# Altium project proj_arhipov_control_board.PrjPcb
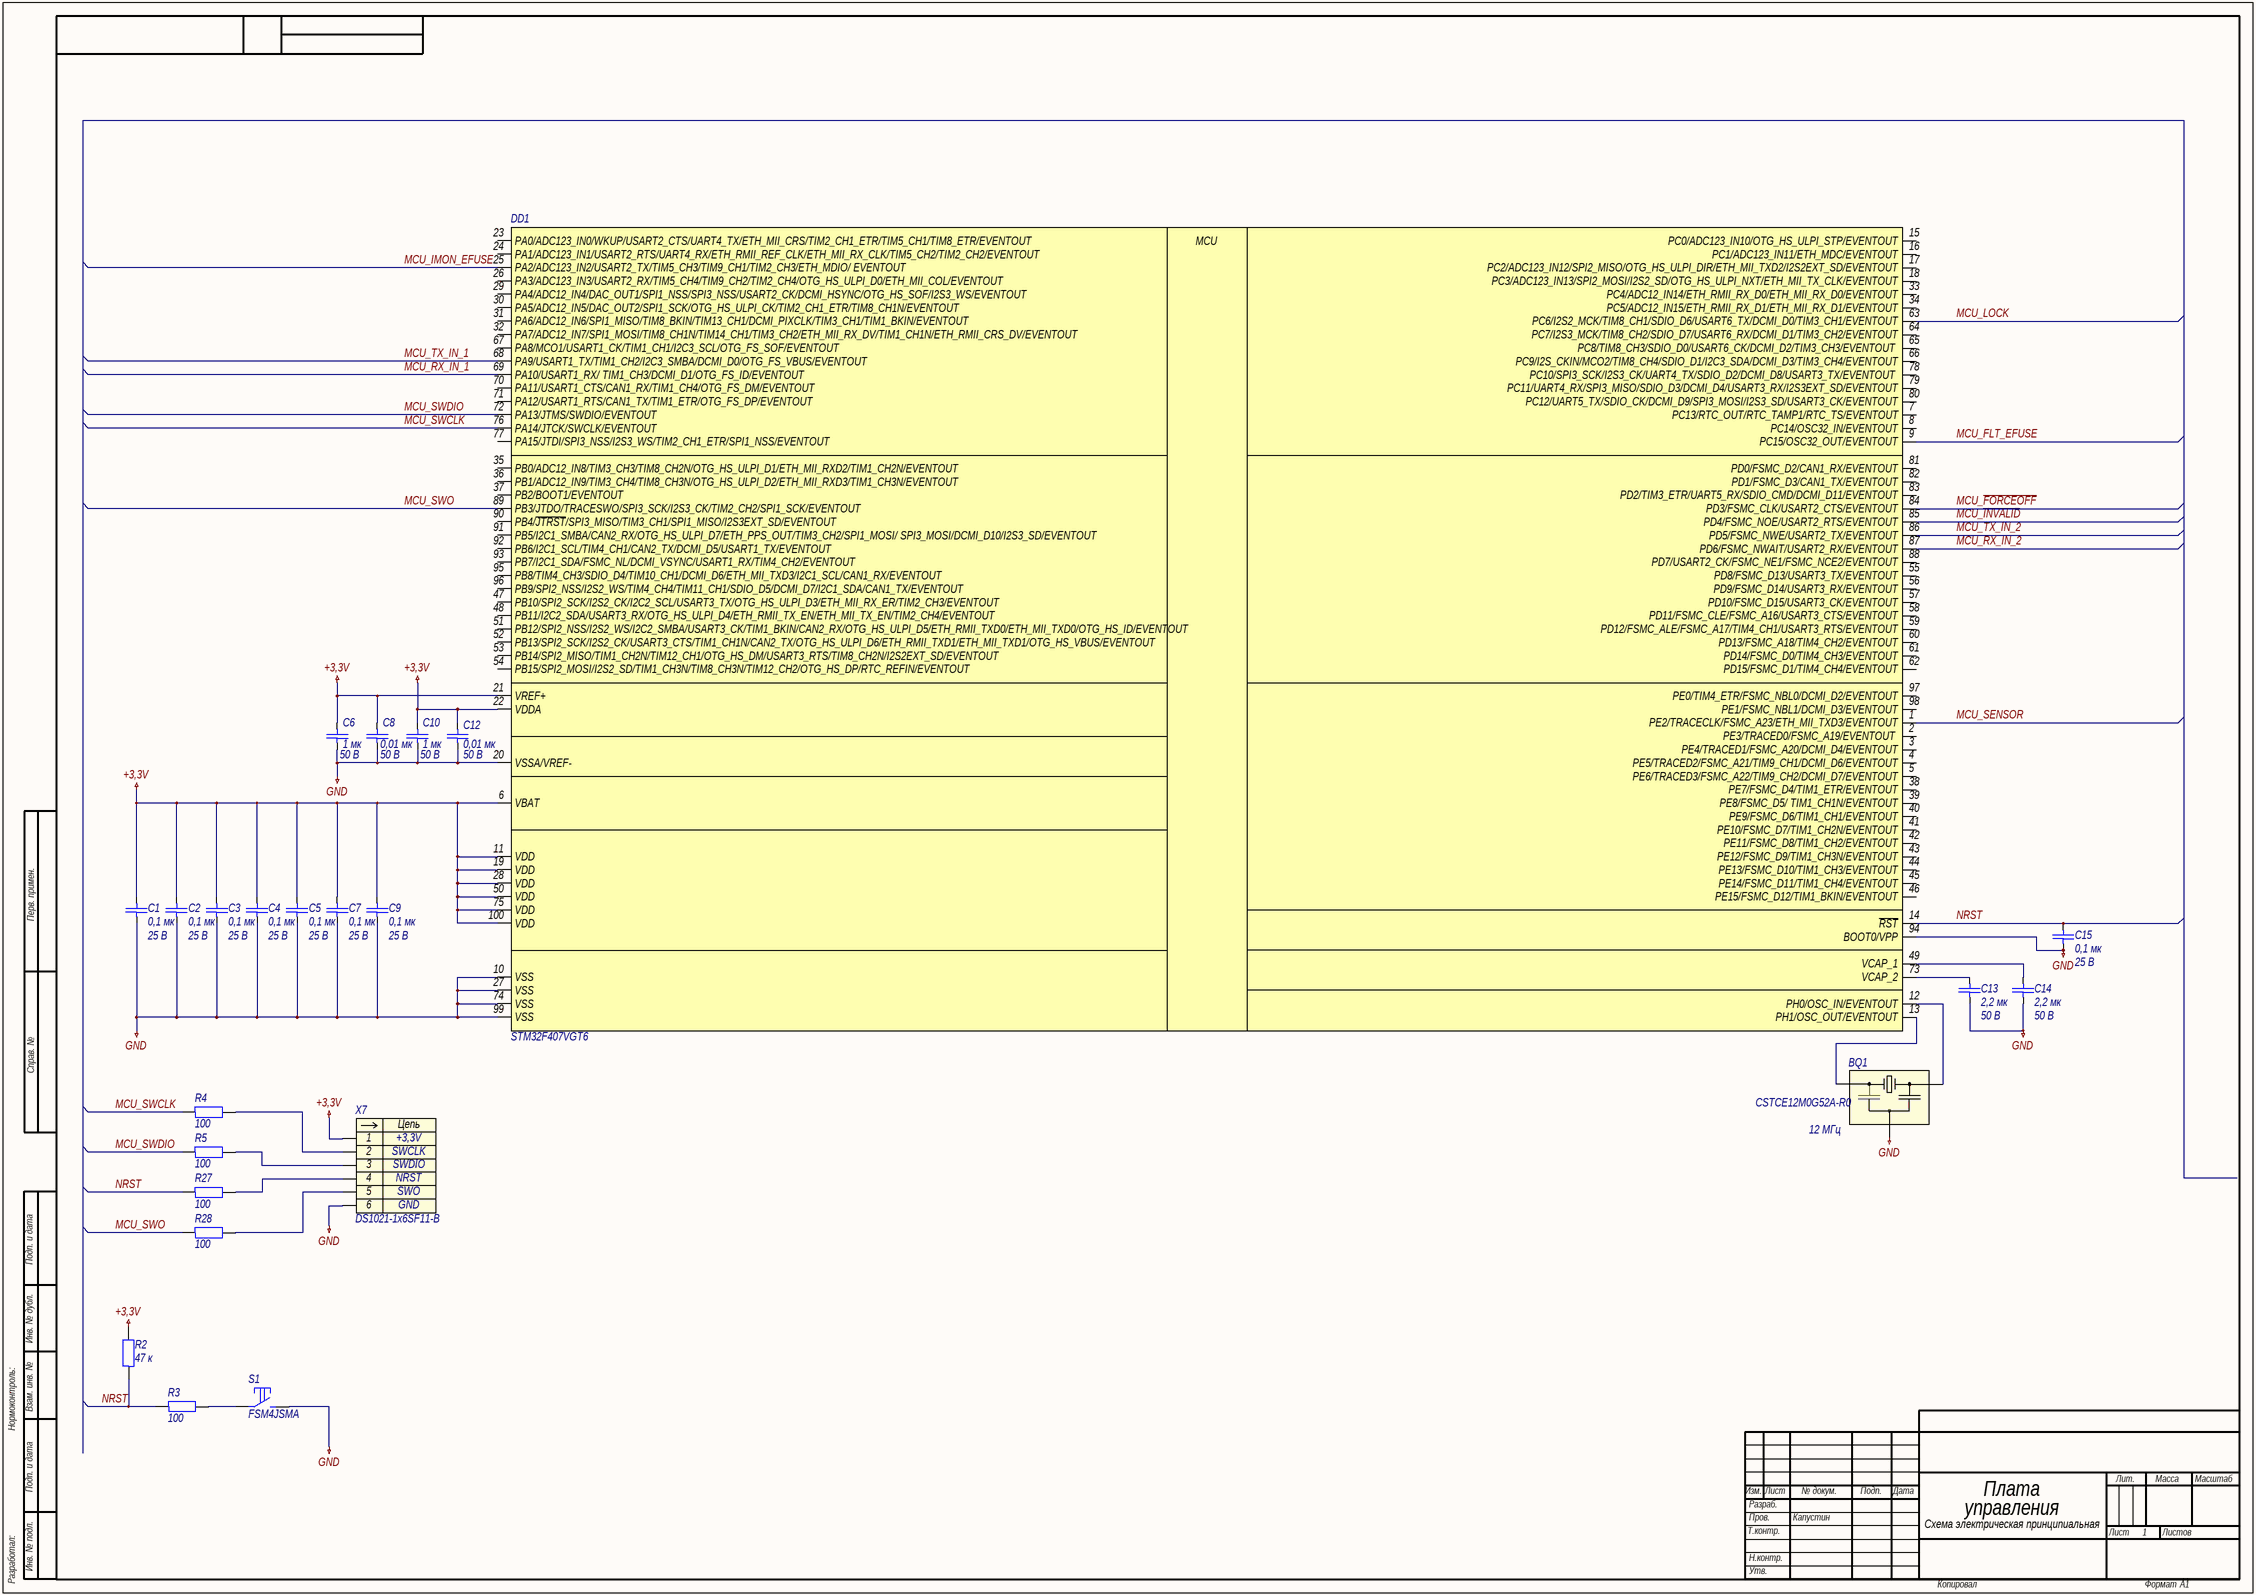
[diagram p0: proj_arhipov_mcu.SchDoc]
approver: Капустин; check: Капустин; designation: СПБПУ.3331506.001; developer: Архипов; document_code: Ý3; document_type: Схема электрическая принципиальная; pcb_dec_number: СПБПУ.3331506.001; project: Плата управления; sheets_total: M; title: Плата управления; title_line_1: Плата; title_line_2: управления
4 sheets, 98 parts. Net scope: global (net labels, ports and power ports of the same name join across sheets).
Board file: proj_arhipov_control_doard.PcbDoc
Sheets:
  proj_arhipov_mcu.SchDoc
  proj_arhipov_buck.SchDoc
  proj_arhipov_uart_rs232.SchDoc
  proj_arhipov_elements_control.SchDoc

## Sheet proj_arhipov_mcu.SchDoc: Плата управления
size 840 x 594 mm; ApprovedBy: Капустин; CheckedBy: Капустин; DrawnBy: Архипов; DocumentNumber: СПБПУ.3331506.001Ý3; SheetNumber: 1; SheetTotal: M; DocumentCode: Ý3; ImagePath: СПБПУ.3331506.001

### Parts
BQ1  CSTCE12M0G52A-R0  Частотa: 12 МГц  [CSTCE-3-320X130X70]
C1  0,1 мк  Напряжение: 25 В  [C0603]
C2  0,1 мк  Напряжение: 25 В  [C0603]
C3  0,1 мк  Напряжение: 25 В  [C0603]
C4  0,1 мк  Напряжение: 25 В  [C0603]
C5  0,1 мк  Напряжение: 25 В  [C0603]
C6  1 мк  Напряжение: 50 В  [C0603]
C7  0,1 мк  Напряжение: 25 В  [C0603]
C8  0,01 мк  Напряжение: 50 В  [C0603]
C9  0,1 мк  Напряжение: 25 В  [C0603]
C10  1 мк  Напряжение: 50 В  [C0603]
C12  0,01 мк  Напряжение: 50 В  [C0603]
C13  2,2 мк  Напряжение: 50 В  [C0603]
C14  2,2 мк  Напряжение: 50 В  [C0603]
C15  0,1 мк  Напряжение: 25 В  [C0603]
DD1  STM32F407VGT6  [LQFP-100-P50-1400X1400X160-L60X22]
R2  47 к  [R0603]
R3  100  [R0603]
R4  100  [R0603]
R5  100  [R0603]
R27  100  [R0603]
R28  100  [R0603]
S1  FSM4JSMA  [FSM4JSMA]
X7  DS1021-1x6SF11-B  [DS1021-1X6SF11-B]

### Nets
+3,3V: C1.1 C2.1 C3.1 C4.1 C5.1 C6.1 C7.1 C8.1 C9.1 C10.1 C12.1 DD1.6(VBAT) DD1.11(VDD) DD1.19(VDD) DD1.21(VREF+) DD1.22(VDDA) DD1.28(VDD) DD1.50(VDD) DD1.75(VDD) DD1.100(VDD) R2.2 X7.1
GND: BQ1.2 C1.2 C2.2 C3.2 C4.2 C5.2 C6.2 C7.2 C8.2 C9.2 C10.2 C12.2 C13.2 C14.2 C15.2 DD1.10(VSS) DD1.20(VSSA/VREF-) DD1.27(VSS) DD1.74(VSS) DD1.94(BOOT0/VPP) DD1.99(VSS) S1.2 X7.6
MCU_~{FORCEOFF}: DD1.84(PD3/FSMC_CLK/USART2_CTS/EVENTOUT)
MCU_FLT_EFUSE: DD1.9(PC15/OSC32_OUT/EVENTOUT)
MCU_~{INVALID}: DD1.85(PD4/FSMC_NOE/USART2_RTS/EVENTOUT)
MCU_IMON_EFUSE: DD1.25(PA2/ADC123_IN2/USART2_TX/TIM5_CH3/TIM9_CH1/TIM2_CH3/ETH_MDIO/_EVENTOUT)
MCU_LOCK: DD1.63(PC6/I2S2_MCK/TIM8_CH1/SDIO_D6/USART6_TX/DCMI_D0/TIM3_CH1/EVENTOUT)
MCU_RX_IN_1: DD1.69(PA10/USART1_RX/_TIM1_CH3/DCMI_D1/OTG_FS_ID/EVENTOUT)
MCU_RX_IN_2: DD1.87(PD6/FSMC_NWAIT/USART2_RX/EVENTOUT)
MCU_SENSOR: DD1.1(PE2/TRACECLK/FSMC_A23/ETH_MII_TXD3/EVENTOUT)
MCU_SWCLK: DD1.76(PA14/JTCK/SWCLK/EVENTOUT) R4.1
MCU_SWDIO: DD1.72(PA13/JTMS/SWDIO/EVENTOUT) R5.1
MCU_SWO: DD1.89(PB3/JTDO/TRACESWO/SPI3_SCK/I2S3_CK/TIM2_CH2/SPI1_SCK/EVENTOUT) R28.1
MCU_TX_IN_1: DD1.68(PA9/USART1_TX/TIM1_CH2/I2C3_SMBA/DCMI_D0/OTG_FS_VBUS/EVENTOUT)
MCU_TX_IN_2: DD1.86(PD5/FSMC_NWE/USART2_TX/EVENTOUT)
NRST: C15.1 DD1.14(~{RST}) R2.1 R3.1 R27.1
NetBQ1_1: BQ1.1 DD1.12(PH0/OSC_IN/EVENTOUT)
NetBQ1_3: BQ1.3 DD1.13(PH1/OSC_OUT/EVENTOUT)
NetC13_1: C13.1 DD1.73(VCAP_2)
NetC14_1: C14.1 DD1.49(VCAP_1)
NetR3_2: R3.2 S1.1
NetR4_2: R4.2 X7.2
NetR5_2: R5.2 X7.3
NetR27_2: R27.2 X7.4
NetR28_2: R28.2 X7.5

Not connected (* = marked no-connect by the designer): DD1 2(PE3/TRACED0/FSMC_A19/EVENTOUT_) 3(PE4/TRACED1/FSMC_A20/DCMI_D4/EVENTOUT) 4(PE5/TRACED2/FSMC_A21/TIM9_CH1/DCMI_D6/EVENTOUT) 5(PE6/TRACED3/FSMC_A22/TIM9_CH2/DCMI_D7/EVENTOUT) 7(PC13/RTC_OUT/RTC_TAMP1/RTC_TS/EVENTOUT) 8(PC14/OSC32_IN/EVENTOUT) 15(PC0/ADC123_IN10/OTG_HS_ULPI_STP/EVENTOUT) 16(PC1/ADC123_IN11/ETH_MDC/EVENTOUT) 17(PC2/ADC123_IN12/SPI2_MISO/OTG_HS_ULPI_DIR/ETH_MII_TXD2/I2S2EXT_SD/EVENTOUT) 18(PC3/ADC123_IN13/SPI2_MOSI/I2S2_SD/OTG_HS_ULPI_NXT/ETH_MII_TX_CLK/EVENTOUT) 23(PA0/ADC123_IN0/WKUP/USART2_CTS/UART4_TX/ETH_MII_CRS/TIM2_CH1_ETR/TIM5_CH1/TIM8_ETR/EVENTOUT) 24(PA1/ADC123_IN1/USART2_RTS/UART4_RX/ETH_RMII_REF_CLK/ETH_MII_RX_CLK/TIM5_CH2/TIM2_CH2/EVENTOUT) 26(PA3/ADC123_IN3/USART2_RX/TIM5_CH4/TIM9_CH2/TIM2_CH4/OTG_HS_ULPI_D0/ETH_MII_COL/EVENTOUT) 29(PA4/ADC12_IN4/DAC_OUT1/SPI1_NSS/SPI3_NSS/USART2_CK/DCMI_HSYNC/OTG_HS_SOF/I2S3_WS/EVENTOUT) 30(PA5/ADC12_IN5/DAC_OUT2/SPI1_SCK/OTG_HS_ULPI_CK/TIM2_CH1_ETR/TIM8_CH1N/EVENTOUT) 31(PA6/ADC12_IN6/SPI1_MISO/TIM8_BKIN/TIM13_CH1/DCMI_PIXCLK/TIM3_CH1/TIM1_BKIN/EVENTOUT) 32(PA7/ADC12_IN7/SPI1_MOSI/TIM8_CH1N/TIM14_CH1/TIM3_CH2/ETH_MII_RX_DV/TIM1_CH1N/ETH_RMII_CRS_DV/EVENTOUT) 33(PC4/ADC12_IN14/ETH_RMII_RX_D0/ETH_MII_RX_D0/EVENTOUT) 34(PC5/ADC12_IN15/ETH_RMII_RX_D1/ETH_MII_RX_D1/EVENTOUT) 35(PB0/ADC12_IN8/TIM3_CH3/TIM8_CH2N/OTG_HS_ULPI_D1/ETH_MII_RXD2/TIM1_CH2N/EVENTOUT) 36(PB1/ADC12_IN9/TIM3_CH4/TIM8_CH3N/OTG_HS_ULPI_D2/ETH_MII_RXD3/TIM1_CH3N/EVENTOUT) 37(PB2/BOOT1/EVENTOUT) 38(PE7/FSMC_D4/TIM1_ETR/EVENTOUT) 39(PE8/FSMC_D5/_TIM1_CH1N/EVENTOUT) 40(PE9/FSMC_D6/TIM1_CH1/EVENTOUT) 41(PE10/FSMC_D7/TIM1_CH2N/EVENTOUT) 42(PE11/FSMC_D8/TIM1_CH2/EVENTOUT) 43(PE12/FSMC_D9/TIM1_CH3N/EVENTOUT) 44(PE13/FSMC_D10/TIM1_CH3/EVENTOUT) 45(PE14/FSMC_D11/TIM1_CH4/EVENTOUT) 46(PE15/FSMC_D12/TIM1_BKIN/EVENTOUT) 47(PB10/SPI2_SCK/I2S2_CK/I2C2_SCL/USART3_TX/OTG_HS_ULPI_D3/ETH_MII_RX_ER/TIM2_CH3/EVENTOUT) 48(PB11/I2C2_SDA/USART3_RX/OTG_HS_ULPI_D4/ETH_RMII_TX_EN/ETH_MII_TX_EN/TIM2_CH4/EVENTOUT) 51(PB12/SPI2_NSS/I2S2_WS/I2C2_SMBA/USART3_CK/TIM1_BKIN/CAN2_RX/OTG_HS_ULPI_D5/ETH_RMII_TXD0/ETH_MII_TXD0/OTG_HS_ID/EVENTOUT) 52(PB13/SPI2_SCK/I2S2_CK/USART3_CTS/TIM1_CH1N/CAN2_TX/OTG_HS_ULPI_D6/ETH_RMII_TXD1/ETH_MII_TXD1/OTG_HS_VBUS/EVENTOUT) 53(PB14/SPI2_MISO/TIM1_CH2N/TIM12_CH1/OTG_HS_DM/USART3_RTS/TIM8_CH2N/I2S2EXT_SD/EVENTOUT) 54(PB15/SPI2_MOSI/I2S2_SD/TIM1_CH3N/TIM8_CH3N/TIM12_CH2/OTG_HS_DP/RTC_REFIN/EVENTOUT) 55(PD8/FSMC_D13/USART3_TX/EVENTOUT) 56(PD9/FSMC_D14/USART3_RX/EVENTOUT) 57(PD10/FSMC_D15/USART3_CK/EVENTOUT) 58(PD11/FSMC_CLE/FSMC_A16/USART3_CTS/EVENTOUT) 59(PD12/FSMC_ALE/FSMC_A17/TIM4_CH1/USART3_RTS/EVENTOUT) 60(PD13/FSMC_A18/TIM4_CH2/EVENTOUT) 61(PD14/FSMC_D0/TIM4_CH3/EVENTOUT) 62(PD15/FSMC_D1/TIM4_CH4/EVENTOUT) 64(PC7/I2S3_MCK/TIM8_CH2/SDIO_D7/USART6_RX/DCMI_D1/TIM3_CH2/EVENTOUT) 65(PC8/TIM8_CH3/SDIO_D0/USART6_CK/DCMI_D2/TIM3_CH3/EVENTOUT_) 66(PC9/I2S_CKIN/MCO2/TIM8_CH4/SDIO_D1/I2C3_SDA/DCMI_D3/TIM3_CH4/EVENTOUT) 67(PA8/MCO1/USART1_CK/TIM1_CH1/I2C3_SCL/OTG_FS_SOF/EVENTOUT) 70(PA11/USART1_CTS/CAN1_RX/TIM1_CH4/OTG_FS_DM/EVENTOUT) 71(PA12/USART1_RTS/CAN1_TX/TIM1_ETR/OTG_FS_DP/EVENTOUT) 77(PA15/JTDI/SPI3_NSS/I2S3_WS/TIM2_CH1_ETR/SPI1_NSS/EVENTOUT) 78(PC10/SPI3_SCK/I2S3_CK/UART4_TX/SDIO_D2/DCMI_D8/USART3_TX/EVENTOUT_) 79(PC11/UART4_RX/SPI3_MISO/SDIO_D3/DCMI_D4/USART3_RX/I2S3EXT_SD/EVENTOUT) 80(PC12/UART5_TX/SDIO_CK/DCMI_D9/SPI3_MOSI/I2S3_SD/USART3_CK/EVENTOUT) 81(PD0/FSMC_D2/CAN1_RX/EVENTOUT) 82(PD1/FSMC_D3/CAN1_TX/EVENTOUT) 83(PD2/TIM3_ETR/UART5_RX/SDIO_CMD/DCMI_D11/EVENTOUT) 88(PD7/USART2_CK/FSMC_NE1/FSMC_NCE2/EVENTOUT) 90(PB4/~{JTRST}/SPI3_MISO/TIM3_CH1/SPI1_MISO/I2S3EXT_SD/EVENTOUT) 91(PB5/I2C1_SMBA/CAN2_RX/OTG_HS_ULPI_D7/ETH_PPS_OUT/TIM3_CH2/SPI1_MOSI/_SPI3_MOSI/DCMI_D10/I2S3_SD/EVENTOUT) 92(PB6/I2C1_SCL/TIM4_CH1/CAN2_TX/DCMI_D5/USART1_TX/EVENTOUT) 93(PB7/I2C1_SDA/FSMC_NL/DCMI_VSYNC/USART1_RX/TIM4_CH2/EVENTOUT) 95(PB8/TIM4_CH3/SDIO_D4/TIM10_CH1/DCMI_D6/ETH_MII_TXD3/I2C1_SCL/CAN1_RX/EVENTOUT) 96(PB9/SPI2_NSS/I2S2_WS/TIM4_CH4/TIM11_CH1/SDIO_D5/DCMI_D7/I2C1_SDA/CAN1_TX/EVENTOUT) 97(PE0/TIM4_ETR/FSMC_NBL0/DCMI_D2/EVENTOUT) 98(PE1/FSMC_NBL1/DCMI_D3/EVENTOUT)

### Notes on the sheet
- Перв. примен.
- Справ. №
- Подп. и дата
- Инв. № дубл.
- Нормоконтроль:
- Взам. инв. №
- Изм.
- Лист
- № докум.
- Подп.
- Дата
- Лит.
- Масса
- Масштаб
- Т.контр.
- Пров.
- Разраб.
- Листов
- Разработал:
- Инв. № подл.
- Н.контр.
- Утв.
- Копировал
- Формат
- А1
- (in symbol dd0001) MCU
- (in symbol x0016) Цепь

### Library data of the parts
BQ1 = bq0001: =Описание; ID: bq0001; Фамилия: Самарин; Описание: Кварцевый резонатор 12 МГц; Производитель: Murata Manufacturing Co., Ltd.; Корпус: 3,20 x 1,30 x 0,70; Наименование: CSTCE12M0G52A-R0; Частота: 12 МГц; HelpURL: https://www.murata.com/en-us/products/productdetail?partno=CSTCE12M0G52A-R0
C1-C5 C7 C9 C15 = c0058: =Описание; ID: c0058; Фамилия: Паньков; Описание: Конденсатор керамический чип 0603 100 нФ 25 В ±10 %; Наименование: CC0603KRX7R8BB104; Производитель: YAGEO Corp.; Отклонение: ±10 %; Рабочие температуры: от –55 °С до +125 °С; Температурный коэффициент емкости: X7R; Корпус: 0603; Номинал: 0,1 мк; Номинальное напряжение: 25 В; HelpURL: https://www.yageo.com/upload/media/product/productsearch/datasheet/mlcc/UPY-GPHC_X7R_6.3V-to-50V_20.pdf
C6 C10 = c0091: =Описание; ID: c0091; Фамилия: Самарин; Описание: Конденсатор керамический чип 0603 1 мкФ 50 В ±10 %; Наименование: CC0603KPX5R9BB105; Производитель: YAGEO Corp.; Отклонение: ±10 %; Рабочие температуры: от –55 °С до +85 °С; Температурный коэффициент емкости: X5R; Корпус: 0603; Номинал: 1 мк; Номинальное напряжение: 50 В; HelpURL: https://www.yageo.com/upload/media/product/productsearch/datasheet/mlcc/UPY-GPHC_X5R_4V-to-50V_26.pdf
C8 C12 = c0036: =Описание; ID: c0036; Фамилия: Паньков; Описание: Конденсатор керамический чип 0603 10 нФ 50 В ±10 %; Наименование: CC0603KRX7R9BB103; Производитель: YAGEO Corp.; Отклонение: ±10 %; Рабочие температуры: от –55 °С до +125 °С; Температурный коэффициент емкости: X7R; Корпус: 0603; Номинал: 0,01 мк; Номинальное напряжение: 50 В; HelpURL: https://www.yageo.com/upload/media/product/productsearch/datasheet/mlcc/UPY-GPHC_X7R_6.3V-to-50V_20.pdf
C13 C14 = c0102: =Описание; ID: c0102; Фамилия: Самарин; Описание: Конденсатор керамический чип 0603 2,2 мкФ 50 В ±10 %; Наименование: CC0603KRX5R9BB225; Производитель: YAGEO Corp.; Отклонение: ±10 %; Рабочие температуры: от –55 °С до +85 °С; Температурный коэффициент емкости: X5R; Корпус: 0603; Номинал: 2,2 мк; Номинальное напряжение: 50 В; HelpURL: https://www.yageo.com/upload/media/product/productsearch/datasheet/mlcc/UPY-GPHC_X5R_4V-to-50V_26.pdf
DD1 = dd0001: =Описание; ID: dd0001; Фамилия: Паньков; Описание: ARM Cortex-M4 32-разрядный микроконтроллер 168 МГц 1 Мбайт FLASH-памяти; Производитель: STMicroelectronics; Рабочее напряжение: от 1,8 В до 3,6 В; Максимальная тактовая частота: 168 МГц; Поддерживаемые интерфейсы: CAN, I2C, SDIO, I2S/SPI, UART/USART, USB; Рабочие температуры: от –40 °С до +85 °С; Корпус: LQFP-100; Наименование: STM32F407VGT6; HelpURL: https://www.st.com/en/microcontrollers-microprocessors/stm32f407vg.html
R2 = r0084: =Описание; ID: r0084; Фамилия: Паньков; Описание: Резистор чип 0603 47 кОм ±1 % 0,1 Вт; Наименование: RC0603FR-0747KL; Производитель: YAGEO Corp.; Отклонение: ±1 %; Номинальное напряжение: 75 В; Номинальный ток: 1 А; Рабочие температуры: от –55 °С до +155 °С; Корпус: 0603; Примечание: Ряд E24; Номинал: 47 к; HelpURL: https://www.yageo.com/upload/media/product/productsearch/datasheet/rchip/PYu-RC_Group_51_RoHS_L_11.pdf
R3-R5 R27 R28 = r0007: =Описание; ID: r0007; Фамилия: Самарин; Описание: Резистор чип 0603 100 Ом ±1 % 0,1 Вт; Наименование: RC0603FR‍‐07100RL; Производитель: YAGEO Corp.; Отклонение: ±1 %; Номинальное напряжение: 75 В; Номинальный ток: 1 А; Рабочие температуры: от –55 °С до +155 °С; Корпус: 0603; Примечание: Ряд E24; Номинал: 100; HelpURL: https://www.yageo.com/upload/media/product/productsearch/datasheet/rchip/PYu-RC_Group_51_RoHS_L_11.pdf
S1 = s0001: =Описание; ID: s0001; Фамилия: Паньков; Описание: Тактовая кнопка поверхностного монтажа; Производитель: TE Connectivity; Ток нагрузки: 50 мА @ 24 В; Сопротивление контакта: 100 мОм; Количество контактов: 4; Рабочие температуры: от –35 °С до +85 °С; Промывка: Запрещена; Корпус: 6,00 x 6,00 x 4,98; Наименование: FSM4JSMA; HelpURL: https://www.te.com/usa-en/product-4-1437565-1.html
X7 = x0016: =Описание; Contact_1: +3,3V; Contact_2: SWCLK; Contact_3: SWDIO; Contact_4: NRST; Contact_5: SWO; Contact_6: GND; ID: x0016; Фамилия: Паньков; Описание: PLS 6 pin 2,54 мм вилка прямой; Производитель: Connfly Electronic Co., Ltd.; Наименование: DS1021-1x6SF11-B; HelpURL: http://en.connfly.group/product/xVkr=EusQssAN0gN=Aos=mU+UrVkR9kqEAN0gN9g+WqANB+A

## Sheet proj_arhipov_buck.SchDoc: Плата управления
size 594 x 420 mm; ApprovedBy: Капустин; CheckedBy: Капустин; DrawnBy: Архипов; DocumentNumber: СПБПУ.3331506.001Ý3; SheetNumber: 2; SheetTotal: M; DocumentCode: Ý3; ImagePath: СПБПУ.3331506.001
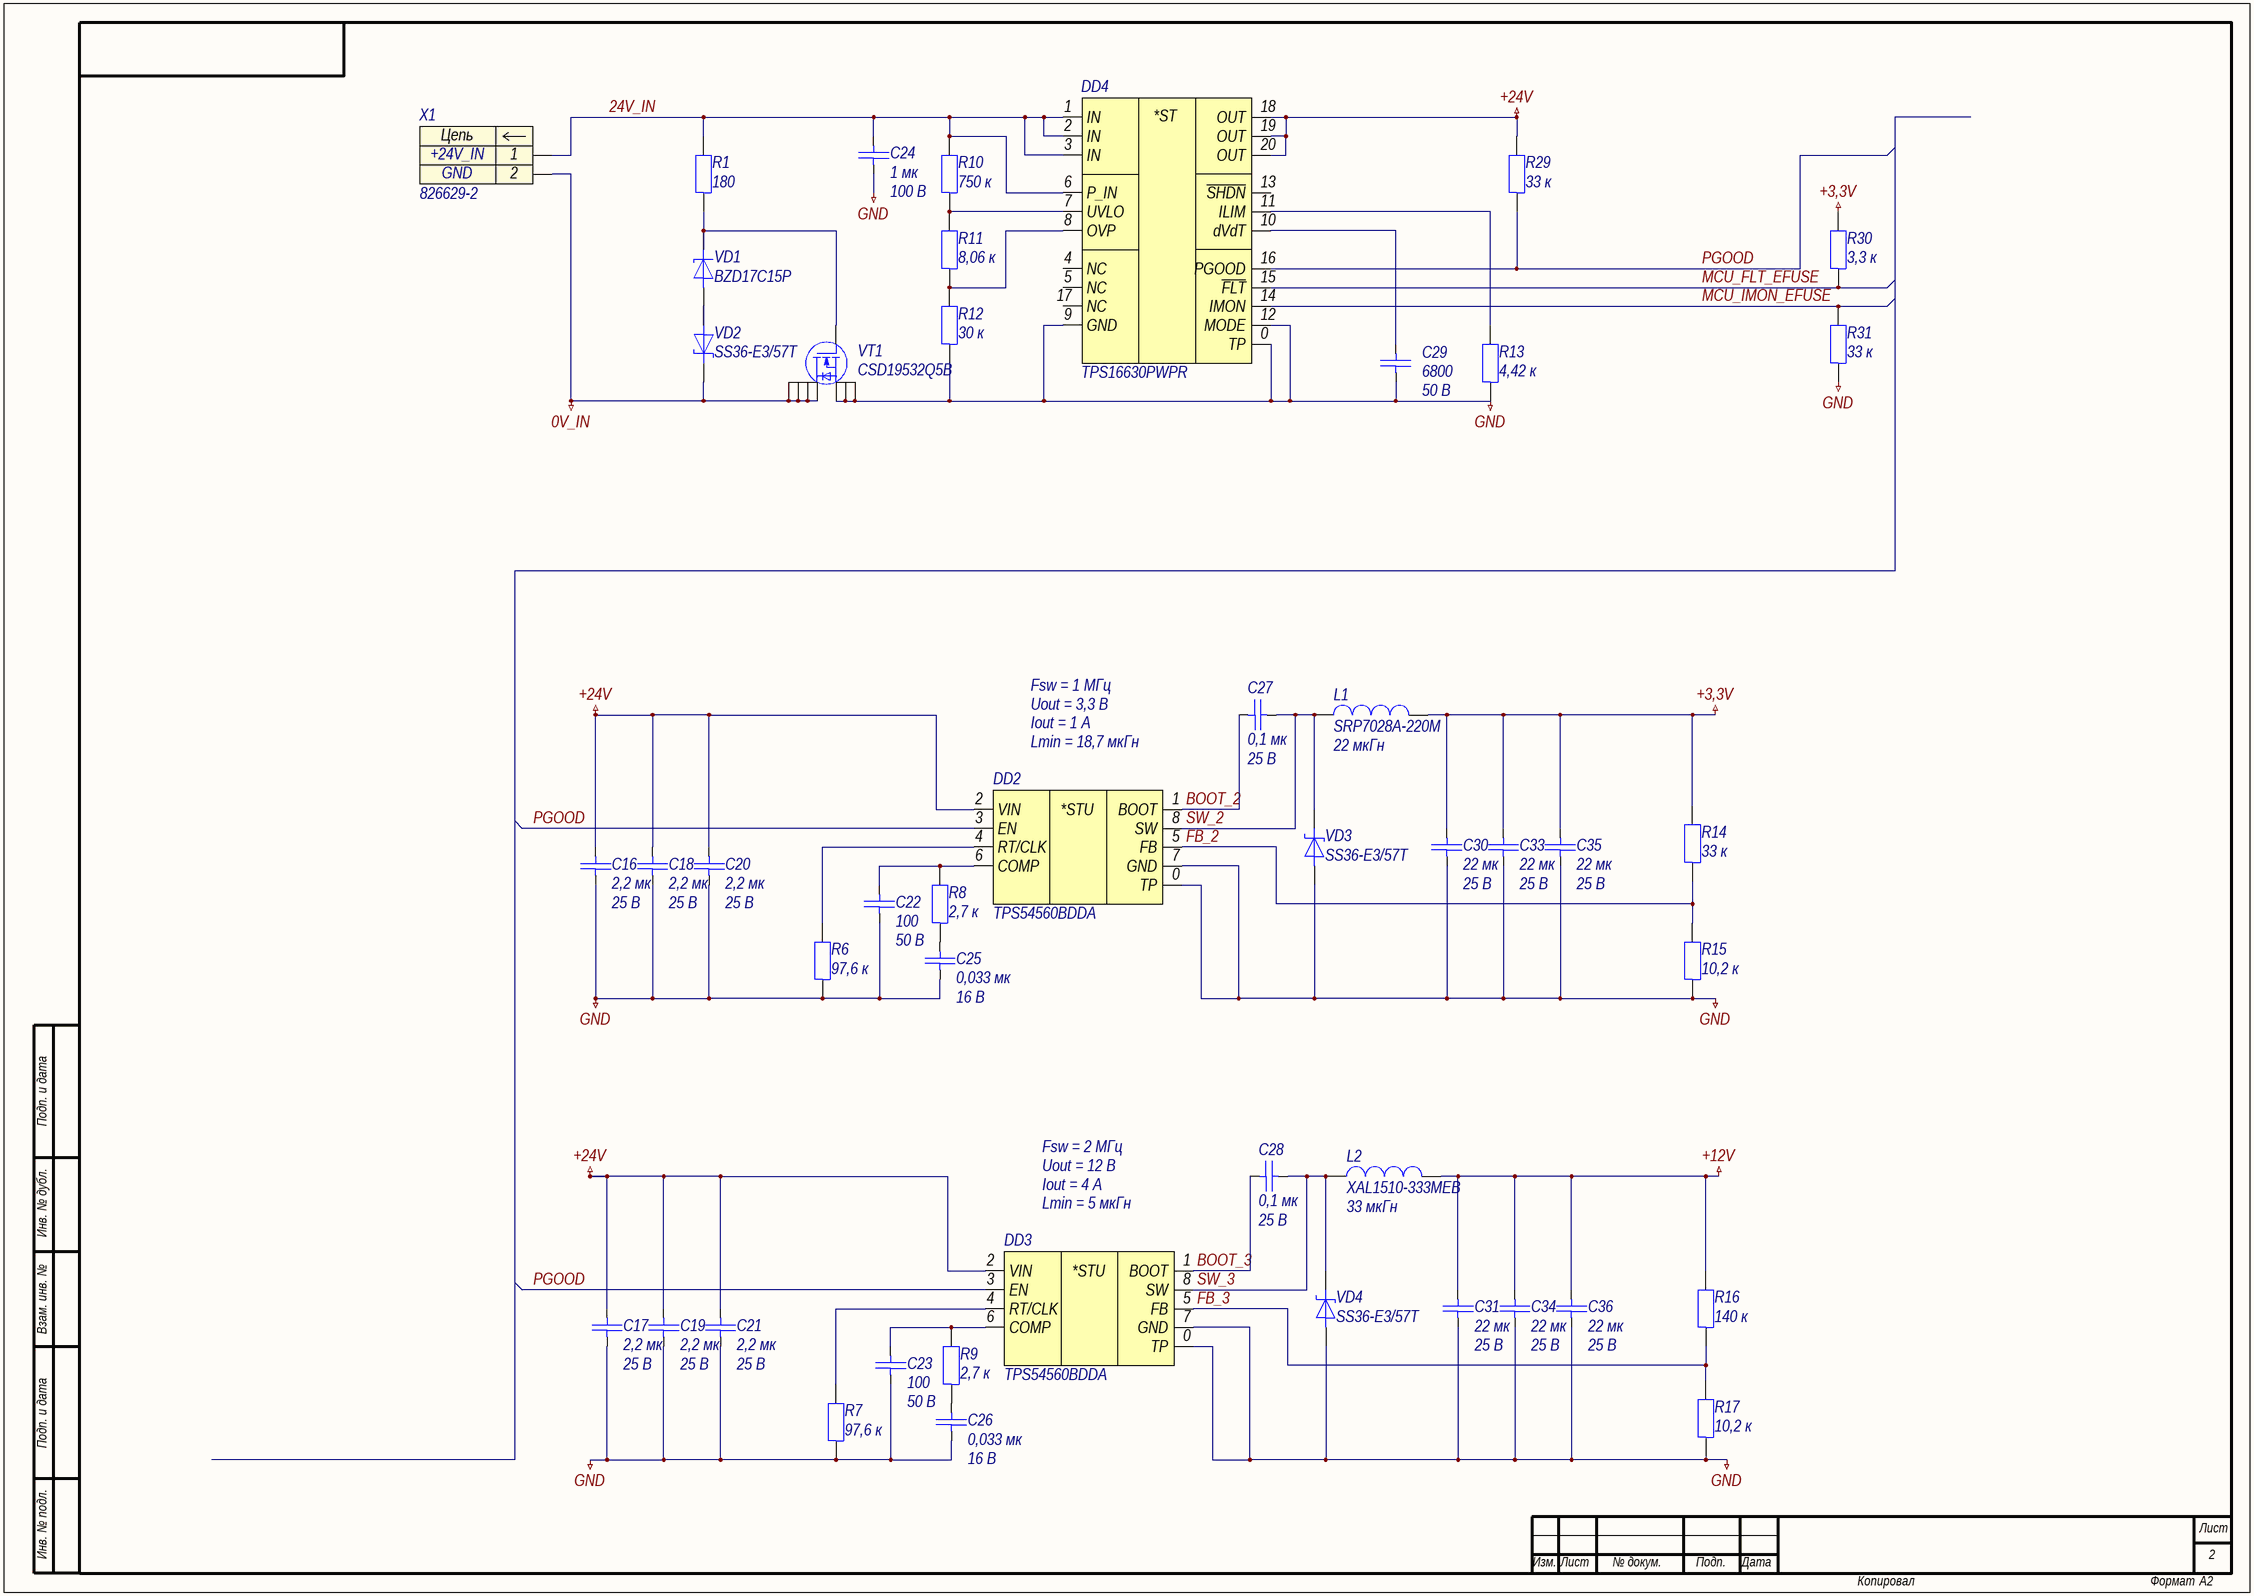
[diagram p1: proj_arhipov_buck.SchDoc]

### Parts
C16  2,2 мк  Напряжение: 25 В  [C0603]
C17  2,2 мк  Напряжение: 25 В  [C0603]
C18  2,2 мк  Напряжение: 25 В  [C0603]
C19  2,2 мк  Напряжение: 25 В  [C0603]
C20  2,2 мк  Напряжение: 25 В  [C0603]
C21  2,2 мк  Напряжение: 25 В  [C0603]
C22  100  Напряжение: 50 В  [C0402]
C23  100  Напряжение: 50 В  [C0402]
C24  1 мк  Напряжение: 100 В  [C1206]
C25  0,033 мк  Напряжение: 16 В  [C0603]
C26  0,033 мк  Напряжение: 16 В  [C0603]
C27  0,1 мк  Напряжение: 25 В  [C0603]
C28  0,1 мк  Напряжение: 25 В  [C0603]
C29  6800  Напряжение: 50 В  [C0402]
C30  22 мк  Напряжение: 25 В  [C1206]
C31  22 мк  Напряжение: 25 В  [C1206]
C33  22 мк  Напряжение: 25 В  [C1206]
C34  22 мк  Напряжение: 25 В  [C1206]
C35  22 мк  Напряжение: 25 В  [C1206]
C36  22 мк  Напряжение: 25 В  [C1206]
DD2  TPS54560BDDA  [HSOIC-8]
DD3  TPS54560BDDA  [HSOIC-8]
DD4  TPS16630PWPR  [HTSSOP-20]
L1  SRP7028A-220M  Индуктивность: 22 мкГн  [SRP-2-730X660X280]
L2  XAL1510-333MEB  Индуктивность: 33 мкГн  [XAL-2-1620X1520X1100]
R1  180  [R0603]
R6  97,6 к  [R0603]
R7  97,6 к  [R0603]
R8  2,7 к  [R0603]
R9  2,7 к  [R0603]
R10  750 к  [R0603]
R11  8,06 к  [R0603]
R12  30 к  [R0603]
R13  4,42 к  [R0603]
R14  33 к  [R0603]
R15  10,2 к  [R0603]
R16  140 к  [R0603]
R17  10,2 к  [R0603]
R29  33 к  [R0603]
R30  3,3 к  [R0603]
R31  33 к  [R0603]
VD1  BZD17C15P  [DO-219AB]
VD2  SS36-E3/57T  [DO-214AB]
VD3  SS36-E3/57T  [DO-214AB]
VD4  SS36-E3/57T  [DO-214AB]
VT1  CSD19532Q5B  [SON-8-500X600X100]
X1  826629-2  [TE_826629-2]

### Nets
0V_IN: VD2.1 VT1.5(D) VT1.6(D) VT1.7(D) VT1.8(D) X1.2
+3,3V: C30.1 C33.1 C35.1 L1.2 R14.2 R30.2
+12V: C31.1 C34.1 C36.1 L2.2 R16.2
+24V: C16.1 C17.1 C18.1 C19.1 C20.1 C21.1 DD2.2(VIN) DD3.2(VIN) DD4.18(OUT) DD4.19(OUT) DD4.20(OUT) R29.2
GND: C16.2 C17.2 C18.2 C19.2 C20.2 C21.2 C22.2 C23.2 C24.2 C25.2 C26.2 C29.2 C30.2 C31.2 C33.2 C34.2 C35.2 C36.2 DD2.0(TP) DD2.7(GND) DD3.0(TP) DD3.7(GND) DD4.0(TP) DD4.9(GND) DD4.12(MODE) R6.1 R7.1 R12.1 R13.1 R15.1 R17.1 R31.1 VD3.2 VD4.2 VT1.1(S) VT1.2(S) VT1.3
24V_IN: C24.1 DD4.1(IN) DD4.2(IN) DD4.3(IN) DD4.6(P_IN) R1.2 R10.2 X1.1
BOOT_2: C27.2 DD2.1(BOOT)
BOOT_3: C28.2 DD3.1(BOOT)
FB_2: DD2.5(FB) R14.1 R15.2
FB_3: DD3.5(FB) R16.1 R17.2
MCU_FLT_EFUSE: DD4.15(~{FLT}) R30.1
MCU_IMON_EFUSE: DD4.14(IMON) R31.2
PGOOD: DD2.3(EN) DD3.3(EN) DD4.16(PGOOD) R29.1
SW_2: C27.1 DD2.8(SW) L1.1 VD3.1
SW_3: C28.1 DD3.8(SW) L2.1 VD4.1
NetC22_1: C22.1 DD2.6(COMP) R8.2
NetC23_1: C23.1 DD3.6(COMP) R9.2
NetC25_1: C25.1 R8.1
NetC26_1: C26.1 R9.1
NetC29_1: C29.1 DD4.10(dVdT)
NetDD2_4: DD2.4(RT/CLK) R6.2
NetDD3_4: DD3.4(RT/CLK) R7.2
NetDD4_7: DD4.7(UVLO) R10.1 R11.2
NetDD4_8: DD4.8(OVP) R11.1 R12.2
NetDD4_11: DD4.11(ILIM) R13.2
NetR1_1: R1.1 VD1.1 VT1.4(G)
NetVD1_2: VD1.2 VD2.2

Not connected (* = marked no-connect by the designer): DD4 4(NC) 5(NC) 13(~{SHDN}) 17(NC)

### Notes on the sheet
- Fsw = 1 МГц
- Uout = 3,3 В
- Iout = 1 А
- Lmin = 18,7 мкГн
- Fsw = 2 МГц
- Uout = 12 В
- Iout = 4 А
- Lmin = 5 мкГн
- Подп. и дата
- Инв. № дубл.
- Взам. инв. №
- Инв. № подл.
- Лист
- Изм.
- № докум.
- Подп.
- Дата
- Копировал
- Формат
- А2
- (in symbol 826629-2) Цепь
- (in symbol dd0002) *ST
- (in symbol dd0009) *STU

### Library data of the parts
C16-C21 = c0100: =Описание; ID: c0100; Фамилия: Паньков; Описание: Конденсатор керамический чип 0603 2,2 мкФ 25 В ±10 %; Наименование: CC0603KRX5R8BB225; Производитель: YAGEO Corp.; Отклонение: ±10 %; Рабочие температуры: от –55 °С до +85 °С; Температурный коэффициент емкости: X5R; Корпус: 0603; Номинал: 2,2 мк; Номинальное напряжение: 25 В; HelpURL: https://www.yageo.com/upload/media/product/productsearch/datasheet/mlcc/UPY-GPHC_X5R_4V-to-50V_26.pdf
C22 C23 = c0004: =Описание; ID: c0004; Фамилия: Ларионов; Описание: Конденсатор керамический чип 0402 100 пФ 50 В ±1 %; Наименование: CL05C101FB5NNNC; Производитель: Samsung Electro-Mechanics; Отклонение: ±1 %; Рабочие температуры: от –55 °С до +125 °С; Температурный коэффициент емкости: C0G; Корпус: 0402; Номинал: 100; Номинальное напряжение: 50 В; HelpURL: http://product.samsungsem.com/mlcc/CL05C101FB5NNN.do
C24 = c0093: =Описание; ID: c0093; Фамилия: Ларионов; Описание: Конденсатор керамический чип 1206 1 мкФ 100 В ±10 %; Наименование: CC1206KKX7R0BB105; Производитель: YAGEO Corp.; Отклонение: ±10 %; Рабочие температуры: от –55 °С до +125 °С; Температурный коэффициент емкости: X7R; Корпус: 1206; Номинал: 1 мк; Номинальное напряжение: 100 В; HelpURL: https://www.yageo.com/upload/media/product/productsearch/datasheet/mlcc/UPY-NP0X7R_MV_100-to-630V_22.pdf
C25 C26 = c0047: =Описание; ID: c0047; Фамилия: Ларионов; Описание: Конденсатор керамический чип 0603 33 нФ 16 В ±5 %; Наименование: CC0603JPX7R7BB333; Производитель: YAGEO Corp.; Отклонение: ±5 %; Рабочие температуры: от –55 °С до +125 °С; Температурный коэффициент емкости: X7R; Корпус: 0603; Номинал: 0,033 мк; Номинальное напряжение: 16 В; HelpURL: https://www.yageo.com/upload/media/product/productsearch/datasheet/mlcc/UPY-GPHC_X7R_6.3V-to-50V_20.pdf
C27 C28 = c0058: as C1 on sheet proj_arhipov_mcu; Номинал: 0,1 мк; Номинальное напряжение: 25 В; HelpURL: https://www.yageo.com/upload/media/product/productsearch/datasheet/mlcc/UPY-GPHC_X7R_6.3V-to-50V_20.pdf
C29 = c0005: =Описание; ID: c0005; Фамилия: Жернаков; Описание: Конденсатор керамический чип 0402 6,8 нФ 50 В ±5 %; Наименование: CL05B682JB5NNNC; Производитель: Samsung Electro-Mechanics; Отклонение: ±5 %; Рабочие температуры: от –55 °С до +125 °С; Температурный коэффициент емкости: X7R; Корпус: 0402; Номинал: 6800; Номинальное напряжение: 50 В; HelpURL: http://product.samsungsem.com/mlcc/CL05B682JB5NNN.do
C30 C31 C33-C36 = c0139: =Описание; ID: c0139; Фамилия: Паньков; Описание: Конденсатор керамический чип 1206 22 мкФ 25 В ±10 %; Наименование: CC1206KKX5R8BB226; Производитель: YAGEO Corp.; Отклонение: ±10 %; Рабочие температуры: от –55 °С до +85 °С; Температурный коэффициент емкости: X5R; Корпус: 1206; Номинал: 22 мк; Номинальное напряжение: 25 В; HelpURL: https://www.yageo.com/upload/media/product/productsearch/datasheet/mlcc/UPY-GPHC_X5R_4V-to-50V_26.pdf
DD2 DD3 = dd0009: =Описание; ID: dd0009; Фамилия: Архипов; Описание: Понижающий преобразователь напряжения 60 В и 5 А; Производитель: Texas Instruments; Входное напряжение: от 4,5 В до 60 В; Выходное напряжение: от 0,8 В до 58,8 В; Коммутируемый ток: до 5 А; Частота переключения: от 100 кГц до 2,5 МГц; Рабочие температуры: от –40 °С до +150 °С; Наименование: TPS54560BDDA; Корпус: HSOIC-8; HelpURL: https://www.ti.com/product/TPS54560B
DD4 = dd0002: =Описание; ID: dd0002; Фамилия: Жернаков; Описание: Защитная микросхема eFuse 60 В и 6 А; Производитель: Texas Instruments; Напряжение: от 4,5 В до 60 В; Максимальное напряжение: 67 В; Ток: от 0,6 А до 6 А; Рабочие температуры: от -40 °С до +125 °С; Наименование: TPS16630PWPR; Корпус: HTSSOP-20; HelpURL: https://www.ti.com/product/TPS1663
L1 = l0011: =Описание; ID: l0011; Фамилия: Ларионов; Описание: Катушка индуктивности 22 мкГн ±20 %; Производитель: Bourns, Inc.; Отклонение: ±20 %; Номинальное активное сопротивление: 165 мОм; Максимальное активное сопротивление: 190 мОм; Резонансная частота: 10 МГц; Номинальный ток (при нагреве на 20 °С/40 °С): 2 А; Ток насыщения: 3,5 А; Рабочее напряжение: не указано; Рабочие температуры: от –55 °С до +150 °С; Корпус: 7,3 x 6,6 x 2,8; Наименование: SRP7028A-220M; Номинал: 22 мкГн; HelpURL: https://www.bourns.com/products/magnetic-products/power-inductors-aec-q200-compliant/product/SRP7028A
L2 = l0004: =Описание; ID: l0004; Фамилия: Водорезов; Описание: Катушка индуктивности 33 мкГн ±20 %; Производитель: Coilcraft, Inc.; Отклонение: ±20 %; Номинальное активное сопротивление: 18,7 мОм; Максимальное активное сопротивление: 20 мОм; Резонансная частота: 5,8 МГц; Номинальный ток (при нагреве на 20 °С/40 °С): 8,6 А; Ток насыщения: 16,7 А; Рабочее напряжение: от 0 В до 60 В; Рабочие температуры: от –40 °С до +125 °С; Корпус: 16,2 x 15,2 x 11; Наименование: XAL1510-333MEB; Номинал: 33 мкГн; HelpURL: https://www.coilcraft.com/en-us/products/power/shielded-inductors/molded-inductor/xal/xal1510
R1 = r0013: =Описание; ID: r0013; Фамилия: Паньков; Описание: Резистор чип 0603 180 Ом ±1 % 0,1 Вт; Наименование: RC0603FR-07180RL; Производитель: YAGEO Corp.; Отклонение: ±1 %; Номинальное напряжение: 75 В; Номинальный ток: 1 А; Рабочие температуры: от –55 °С до +155 °С; Корпус: 0603; Примечание: Ряд E24; Номинал: 180; HelpURL: https://www.yageo.com/upload/media/product/productsearch/datasheet/rchip/PYu-RC_Group_51_RoHS_L_11.pdf
R6 R7 = r0029: =Описание; ID: r0029; Фамилия: Водорезов; Описание: Резистор чип 0603 97,6 кОм ±1 % 0,1 Вт; Наименование: RC0603FR-0797K6L; Производитель: YAGEO Corp.; Отклонение: ±1 %; Номинальное напряжение: 75 В; Рабочие температуры: от -55 °С до +155 °С; Номинальный ток: 1 А; Корпус: 0603; Номинал: 97,6 к; HelpURL: https://www.yageo.com/upload/media/product/productsearch/datasheet/rchip/PYu-RC_Group_51_RoHS_L_11.pdf
R8 R9 = r0042: =Описание; ID: r0042; Фамилия: Паньков; Описание: Резистор чип 0603 2,7 кОм ±1 % 0,1 Вт; Наименование: RC0603FR-072K7L; Производитель: YAGEO Corp.; Отклонение: ±1 %; Номинальное напряжение: 75 В; Номинальный ток: 1 А; Рабочие температуры: от –55 °С до +155 °С; Корпус: 0603; Примечание: Ряд E24; Номинал: 2,7 к; HelpURL: https://www.yageo.com/upload/media/product/productsearch/datasheet/rchip/PYu-RC_Group_51_RoHS_L_11.pdf
R10 = r0125: =Описание; ID: r0125; Фамилия: Паньков; Описание: Резистор чип 0603 750 кОм ±1 % 0,1 Вт; Наименование: RC0603FR-07750KL; Производитель: YAGEO Corp.; Отклонение: ±1 %; Номинальное напряжение: 75 В; Номинальный ток: 1 А; Рабочие температуры: от –55 °С до +155 °С; Корпус: 0603; Примечание: Ряд E24; Номинал: 750 к; HelpURL: https://www.yageo.com/upload/media/product/productsearch/datasheet/rchip/PYu-RC_Group_51_RoHS_L_11.pdf
R11 = r0020: =Описание; ID: r0020; Фамилия: Жернаков; Описание: Резистор чип 0603 8,06 кОм ±1 % 0,1 Вт; Наименование: RC0603FR-078K06L; Производитель: YAGEO Corp.; Отклонение: ±1 %; Номинальное напряжение: 75 В; Рабочие температуры: от -55 °С до +155 °С; Номинальный ток: 1 А; Корпус: 0603; Номинал: 8,06 к; HelpURL: https://www.yageo.com/upload/media/product/productsearch/datasheet/rchip/PYu-RC_Group_51_RoHS_L_11.pdf
R12 = r0077: =Описание; ID: r0077; Фамилия: Паньков; Описание: Резистор чип 0603 30 кОм ±1 % 0,1 Вт; Наименование: RC0603FR-0730KL; Производитель: YAGEO Corp.; Отклонение: ±1 %; Номинальное напряжение: 75 В; Номинальный ток: 1 А; Рабочие температуры: от –55 °С до +155 °С; Корпус: 0603; Примечание: Ряд E24; Номинал: 30 к; HelpURL: https://www.yageo.com/upload/media/product/productsearch/datasheet/rchip/PYu-RC_Group_51_RoHS_L_11.pdf
R13 = r0048: =Описание; ID: r0048; Фамилия: Жернаков; Описание: Резистор чип 0603 4,42 кОм ±1 % 0,1 Вт; Наименование: RC0603FR-074K42L; Производитель: YAGEO Corp.; Отклонение: ±1 %; Номинальное напряжение: 75 В; Номинальный ток: 1 А; Рабочие температуры: от –55 °С до +155 °С; Корпус: 0603; Номинал: 4,42 к; HelpURL: https://www.yageo.com/upload/media/product/productsearch/datasheet/rchip/PYu-RC_Group_51_RoHS_L_11.pdf
R14 R29 R31 = r0078: =Описание; ID: r0078; Фамилия: Паньков; Описание: Резистор чип 0603 33 кОм ±1 % 0,1 Вт; Наименование: RC0603FR-0733KL; Производитель: YAGEO Corp.; Отклонение: ±1 %; Номинальное напряжение: 75 В; Номинальный ток: 1 А; Рабочие температуры: от –55 °С до +155 °С; Корпус: 0603; Примечание: Ряд E24; Номинал: 33 к; HelpURL: https://www.yageo.com/upload/media/product/productsearch/datasheet/rchip/PYu-RC_Group_51_RoHS_L_11.pdf
R15 R17 = r0014: =Описание; ID: r0014; Фамилия: Жернаков; Описание: Резистор чип 0603 10,2 кОм ±1 % 0,1 Вт; Наименование: RC0603FR-0710K2L; Производитель: YAGEO Corp.; Отклонение: ±1 %; Номинальное напряжение: 75 В; Рабочие температуры: от -55 °С до +155 °С; Номинальный ток: 1 А; Корпус: 0603; Номинал: 10,2 к; HelpURL: https://www.yageo.com/upload/media/product/productsearch/datasheet/rchip/PYu-RC_Group_51_RoHS_L_11.pdf
R16 = r0101: =Описание; ID: r0101; Фамилия: Шкабара; Описание: Резистор чип 0603 140 кОм ±1 % 0,1 Вт; Наименование: RC0603FR-07140KL; Производитель: YAGEO Corp.; Отклонение: ±1 %; Номинальное напряжение: 75 В; Номинальный ток: 1 А; Рабочие температуры: от –55 °С до +155 °С; Корпус: 0603; Номинал: 140 к; HelpURL: https://www.yageo.com/upload/media/product/productsearch/datasheet/rchip/PYu-RC_Group_51_RoHS_L_11.pdf
R30 = r0044: =Описание; ID: r0044; Фамилия: Паньков; Описание: Резистор чип 0603 3,3 кОм ±1 % 0,1 Вт; Наименование: RC0603FR-073K3L; Производитель: YAGEO Corp.; Отклонение: ±1 %; Номинальное напряжение: 75 В; Номинальный ток: 1 А; Рабочие температуры: от –55 °С до +155 °С; Корпус: 0603; Примечание: Ряд E24; Номинал: 3,3 к; HelpURL: https://www.yageo.com/upload/media/product/productsearch/datasheet/rchip/PYu-RC_Group_51_RoHS_L_11.pdf
VD1 = vd0016: =Описание; ID: vd0016; Фамилия: Жернаков; Описание: Стабилитрон 15 В; Производитель: Vishay Intertechnology, Inc.; Номинальное напряжение стабилизации: 15 В; Разброс напряжения стабилизации: 13,8...15,6 В; Номинальный ток стабилизации: 50 мА; Рабочие температуры: от –55 °С до +150 °С; Наименование: BZD17C15P; Корпус: DO-219AB; HelpURL: https://www.vishay.com/product?docid=85161
VD2-VD4 = vd0005: =Описание; ID: vd0005; Фамилия: Жернаков; Описание: Диод Шоттки 60 В 3 А; Производитель: Vishay Intertechnology, Inc.; Максимальное прямое напряжение: 0,75 В; Максимальное обратное напряжение: 60 В; Максимальный прямой ток: 3 А; Рабочие температуры: от –55 °С до +150 °С; Наименование: SS36-E3/57T; Корпус: DO-214AB; HelpURL: https://www.vishay.com/product?docid=88751
VT1 = vt0001: =Описание; ID: vt0001; Фамилия: Жернаков; Описание: Полевой N-канальный МДП-транзистор 100 В 17 А; Производитель: Texas Instruments; Напряжение затвор — исток: ±20 В; Напряжение сток — исток: 100 В; Ток стока: 17 А; Сопротивление сток — исток: 0,0057 Ом; Рабочие температуры: от –55 °С до +150 °С; Корпус: SON-8; Наименование: CSD19532Q5B; HelpURL: https://www.ti.com/product/CSD19532Q5B
X1 = 826629-2: Number_of_Positions: 2; Centerline_Pitch: 2.54 mm[.1 in]; MF: TE Connectivity; Product_Type: Connector; Contact_1: +24V_IN; Contact_2: GND; Package: None; Value: *; TE_purchase_URL: https://www.te.com/usa-en/product-826629-2.html?te_bu=Cor&te_type=disp&te_campaign=seda_glo_cor-seda-global-disp-prtnr-fy19-seda-model-bom-cta_sma-317_1&elqCampaignId=32493; EU_RoHS_Compliance: Compliant; Availability: Unavailable; SnapEDA_Link: https://www.snapeda.com/parts/826629-2/TE%20Connectivity%20AMP%20Connectors/view-part/494607/?ref=snap; Price: None; MP: 826629-2

## Sheet proj_arhipov_uart_rs232.SchDoc: Плата управления
size 420 x 297 mm; ApprovedBy: Капустин; CheckedBy: Капустин; DrawnBy: Архипов; DocumentNumber: СПБПУ.3331506.001Ý3; SheetNumber: 3; SheetTotal: M; DocumentCode: Ý3; ImagePath: СПБПУ.3331506.001
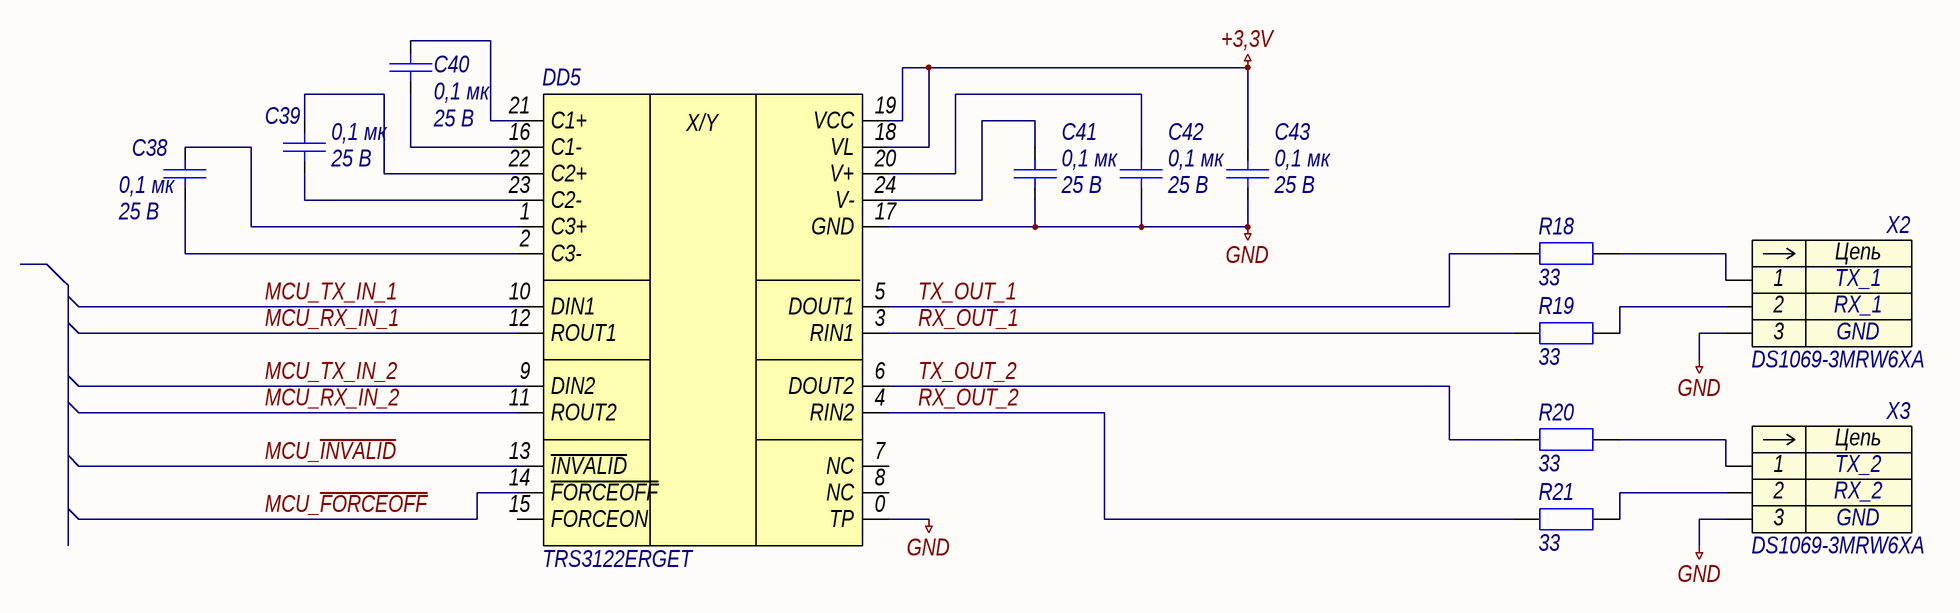
[diagram p2: proj_arhipov_uart_rs232.SchDoc]

### Parts
C38  0,1 мк  Напряжение: 25 В  [C0603]
C39  0,1 мк  Напряжение: 25 В  [C0603]
C40  0,1 мк  Напряжение: 25 В  [C0603]
C41  0,1 мк  Напряжение: 25 В  [C0603]
C42  0,1 мк  Напряжение: 25 В  [C0603]
C43  0,1 мк  Напряжение: 25 В  [C0603]
DD5  TRS3122ERGET  [QFN-24-400X400X80]
R18  33  [R0603]
R19  33  [R0603]
R20  33  [R0603]
R21  33  [R0603]
X2  DS1069-3MRW6XA  [DS1069-3MRW6XA]
X3  DS1069-3MRW6XA  [DS1069-3MRW6XA]

### Nets
+3,3V: C43.2 DD5.18(VL) DD5.19(VCC)
GND: C41.1 C42.1 C43.1 DD5.0(TP) DD5.17(GND) X2.3 X3.3
MCU_~{FORCEOFF}: DD5.14(~{FORCEOFF})
MCU_~{INVALID}: DD5.13(~{INVALID})
MCU_RX_IN_1: DD5.12(ROUT1)
MCU_RX_IN_2: DD5.11(ROUT2)
MCU_TX_IN_1: DD5.10(DIN1)
MCU_TX_IN_2: DD5.9(DIN2)
RX_OUT_1: DD5.3(RIN1) R19.1
RX_OUT_2: DD5.4(RIN2) R21.1
TX_OUT_1: DD5.5(DOUT1) R18.1
TX_OUT_2: DD5.6(DOUT2) R20.1
NetC38_1: C38.1 DD5.2(C3-)
NetC38_2: C38.2 DD5.1(C3+)
NetC39_1: C39.1 DD5.23(C2-)
NetC39_2: C39.2 DD5.22(C2+)
NetC40_1: C40.1 DD5.21(C1+)
NetC40_2: C40.2 DD5.16(C1-)
NetC41_2: C41.2 DD5.24(V-)
NetC42_2: C42.2 DD5.20(V+)
NetR18_2: R18.2 X2.1
NetR19_2: R19.2 X2.2
NetR20_2: R20.2 X3.1
NetR21_2: R21.2 X3.2

Not connected (* = marked no-connect by the designer): DD5 7(NC) 8(NC) 15(FORCEON)

### Notes on the sheet
- Подп. и дата
- Инв. № дубл.
- Взам. инв. №
- Инв. № подл.
- Лист
- Изм.
- № докум.
- Подп.
- Дата
- Копировал
- Формат
- А3
- (in symbol dd0018) X/Y
- (in symbol x0023) Цепь

### Library data of the parts
C38-C43 = c0058: as C1 on sheet proj_arhipov_mcu; Номинал: 0,1 мк; Номинальное напряжение: 25 В; HelpURL: https://www.yageo.com/upload/media/product/productsearch/datasheet/mlcc/UPY-GPHC_X7R_6.3V-to-50V_20.pdf
DD5 = dd0018: =Описание; ID: dd0018; Фамилия: Жернаков; Описание: Приемопередатчик RS-232; Производитель: Texas Instruments; Корпус: QFN-24; Наименование: TRS3122ERGET; HelpURL: https://www.ti.com/product/TRS3122E
R18-R21 = r0006: =Описание; ID: r0006; Фамилия: Жернаков; Описание: Резистор 33 Ом; Наименование: RC0603F330CS; Производитель: Samsung; Отклонение: ±1 %; Номинальное напряжение: 25 В; Рабочие температуры: от -55 °С до +150 °С; Номинальный ток: 0,5 А; Корпус: 0603; Номинал: 33; HelpURL: http://product.samsungsem.com/cr/RC0603F330CS.do
X2 = x0023: =Описание; Contact_1: TX_1; Contact_2: RX_1; Contact_3: GND; ID: x0023; Фамилия: Паньков; Описание: CWF 3 pin Type A 2,5 мм вилка угловой; Производитель: Connfly Electronic Co., Ltd.; Наименование: DS1069-3MRW6XA; HelpURL: http://en.connfly.group/product/xVkr=EusQssAN0gN=Aos=mU+UrVkR9kqEAN0gN0MUR+g+NB+A
X3 = x0023: =Описание; Contact_1: TX_2; Contact_2: RX_2; Contact_3: GND; ID: x0023; Фамилия: Паньков; Описание: CWF 3 pin Type A 2,5 мм вилка угловой; Производитель: Connfly Electronic Co., Ltd.; Наименование: DS1069-3MRW6XA; HelpURL: http://en.connfly.group/product/xVkr=EusQssAN0gN=Aos=mU+UrVkR9kqEAN0gN0MUR+g+NB+A

## Sheet proj_arhipov_elements_control.SchDoc: Плата управления
size 420 x 297 mm; ApprovedBy: Капустин; CheckedBy: Капустин; DrawnBy: Архипов; DocumentNumber: СПБПУ.3331506.001Ý3; SheetNumber: 4; SheetTotal: M; DocumentCode: Ý3; ImagePath: СПБПУ.3331506.001
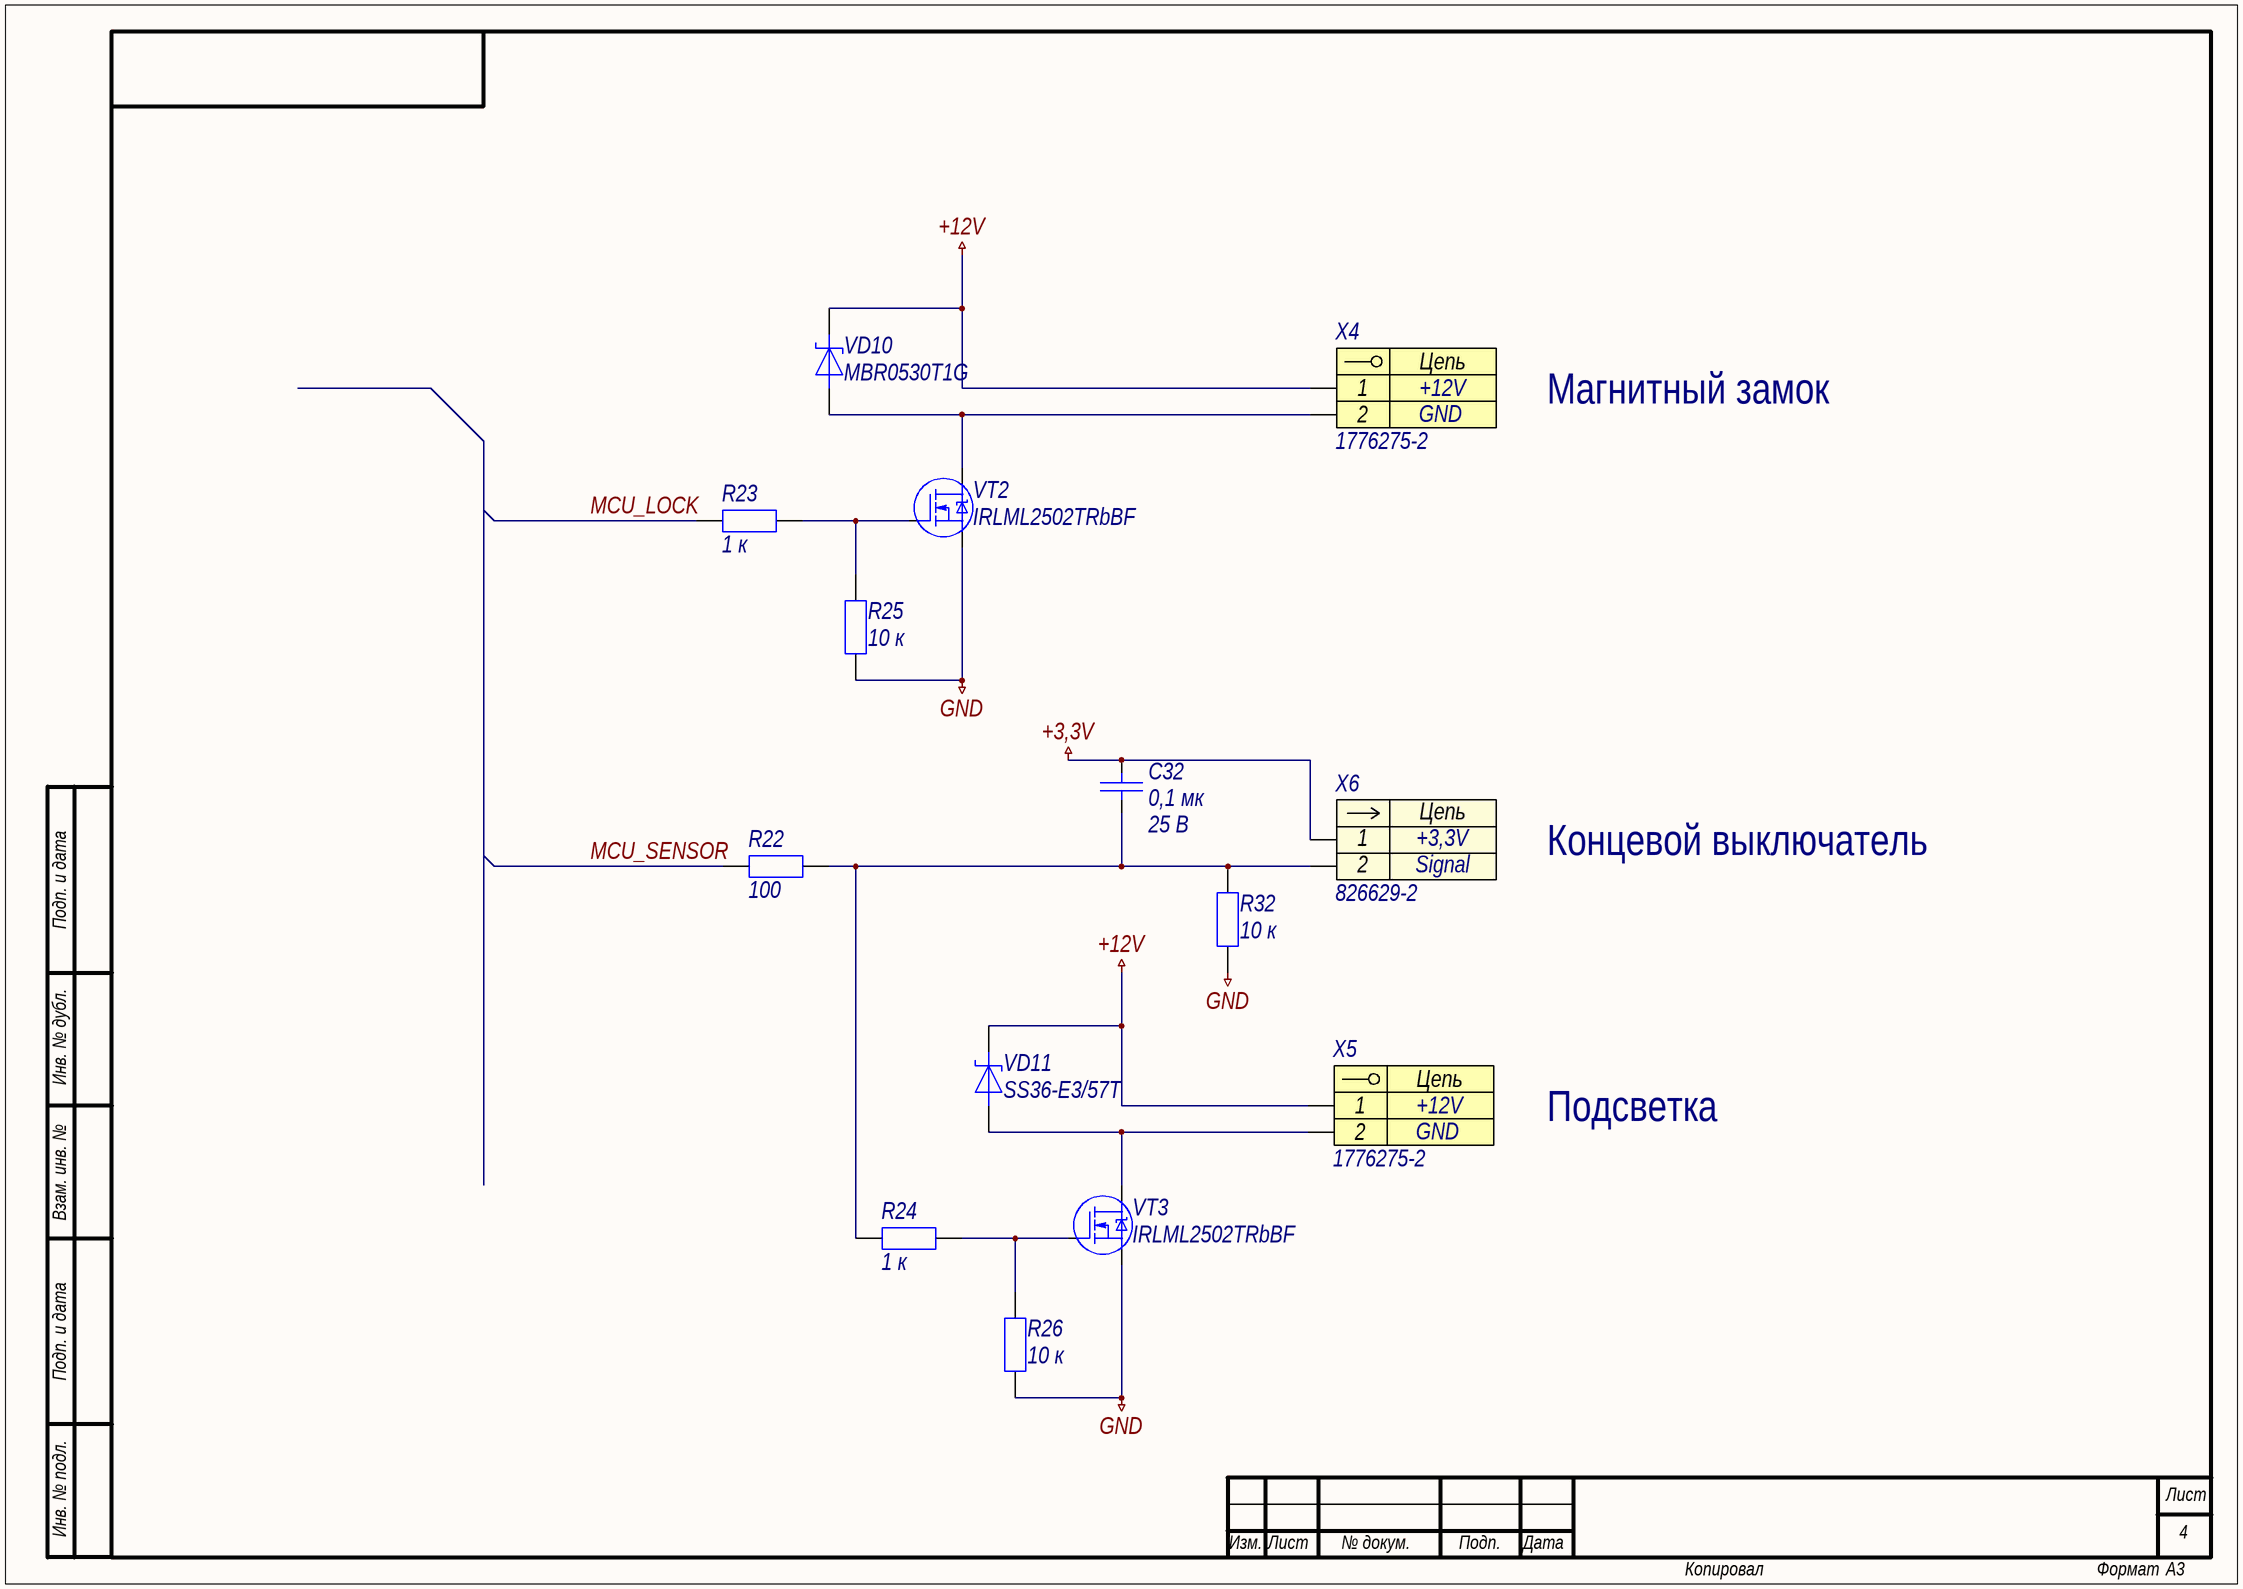
[diagram p3: proj_arhipov_elements_control.SchDoc]

### Parts
C32  0,1 мк  Напряжение: 25 В  [C0603]
R22  100  [R0603]
R23  1 к  [R0603]
R24  1 к  [R0603]
R25  10 к  [R0603]
R26  10 к  [R0603]
R32  10 к  [R0603]
VD10  MBR0530T1G  [SOD-123]
VD11  SS36-E3/57T  [DO-214AB]
VT2  IRLML2502TRbBF  [SOT-23-3]
VT3  IRLML2502TRbBF  [SOT-23-3]
X4  1776275-2  [1776275-2]
X5  1776275-2  [1776275-2]
X6  826629-2  [826629-2]

### Nets
+3,3V: C32.2 X6.1
+12V: VD10.1 VD11.1 X4.1 X5.2
GND: R25.1 R26.1 R32.1 VT2.2(S) VT3.2(S)
MCU_LOCK: R23.1
MCU_SENSOR: R22.1
NetC32_1: C32.1 R22.2 R24.1 R32.2 X6.2
NetR23_2: R23.2 R25.2 VT2.1(G)
NetR24_2: R24.2 R26.2 VT3.1(G)
NetVD10_2: VD10.2 VT2.3(D) X4.2
NetVD11_2: VD11.2 VT3.3(D) X5.1

### Notes on the sheet
- Магнитный замок
- Концевой выключатель
- Подсветка
- Подп. и дата
- Инв. № дубл.
- Взам. инв. №
- Инв. № подл.
- Лист
- Изм.
- № докум.
- Подп.
- Дата
- Копировал
- Формат
- А3
- (in symbol x0005) Цепь
- (in symbol x0008) Цепь

### Library data of the parts
C32 = c0058: as C1 on sheet proj_arhipov_mcu; Номинал: 0,1 мк; Номинальное напряжение: 25 В; HelpURL: https://www.yageo.com/upload/media/product/productsearch/datasheet/mlcc/UPY-GPHC_X7R_6.3V-to-50V_20.pdf
R22 = r0007: as R3 on sheet proj_arhipov_mcu; Номинал: 100; HelpURL: https://www.yageo.com/upload/media/product/productsearch/datasheet/rchip/PYu-RC_Group_51_RoHS_L_11.pdf
R23 R24 = r0031: =Описание; ID: r0031; Фамилия: Ларионов; Описание: Резистор чип 0603 1 кОм ±1 % 0,1 Вт; Наименование: RC0603FR-071KL; Производитель: YAGEO Corp.; Отклонение: ±1 %; Номинальное напряжение: 75 В; Номинальный ток: 1 А; Рабочие температуры: от –55 °С до +155 °С; Корпус: 0603; Примечание: Ряд E24; Номинал: 1 к; HelpURL: https://www.yageo.com/upload/media/product/productsearch/datasheet/rchip/PYu-RC_Group_51_RoHS_L_11.pdf
R25 R26 R32 = r0060: =Описание; ID: r0060; Фамилия: Самарин; Описание: Резистор чип 0603 10 кОм ±1 % 0,1 Вт; Наименование: RC0603FR-0710KL; Производитель: YAGEO Corp.; Отклонение: ±1 %; Номинальное напряжение: 75 В; Номинальный ток: 1 А; Рабочие температуры: от –55 °С до +155 °С; Корпус: 0603; Примечание: Ряд E24; Номинал: 10 к; HelpURL: https://www.yageo.com/upload/media/product/productsearch/datasheet/rchip/PYu-RC_Group_51_RoHS_L_11.pdf
VD10 = vd0001: =Описание; ID: vd0001; Фамилия: Шкабара; Описание: Диод Шоттки 30 В 0,5 А; Производитель: ON Semiconductor; Максимальное прямое напряжение: 0,43 В; Максимальное обратное напряжение: 30 В; Максимальный прямой ток: 0,5 А; Рабочие температуры: от –65 °С до +125 °С; Наименование: MBR0530T1G; Корпус: SOD-123; HelpURL: https://www.onsemi.com/products/discretes-drivers/diodes-rectifiers/schottky-diodes-schottky-rectifiers/mbr0530t1g
VD11 = vd0005: as VD2 on sheet proj_arhipov_buck; Наименование: SS36-E3/57T; Корпус: DO-214AB; HelpURL: https://www.vishay.com/product?docid=88751
VT2 VT3 = vt0002: =Описание; ID: vt0002; Фамилия: Паньков; Описание: Полевой N-канальный МДП-транзистор 20 В 4,2 А; Производитель: Infineon Technologies AG; Напряжение затвор — исток: ±12 В; Напряжение сток — исток: 20 В; Ток стока: 4,2 А; Сопротивление сток — исток: 0,080 Ом; Рабочие температуры: от –55 °С до +150 °С; Наименование: IRLML2502TRbBF; Корпус: SOT-23-3; HelpURL: https://www.infineon.com/cms/en/product/power/mosfet/12v-300v-n-channel-power-mosfet/irlml2502/
X4 X5 = x0005: =Описание; Contact_1: +12V; Contact_2: GND; ID: x0005; Фамилия: Паньков; Описание: Terminal Block 2 pin 3,5 мм; Производитель: TE Connectivity; Наименование: 1776275-2; HelpURL: https://www.te.com/usa-en/product-1776275-2.html
X6 = x0008: =Описание; Contact_1: +3,3V; Contact_2: Signal; ID: x0008; Фамилия: Архипов; Описание: PLS 2 pin 2,54 мм вилка прямой; Производитель: TE Connectivity; Наименование: 826629-2; HelpURL: https://www.te.com/usa-en/product-826629-2.html

## Nets that join several sheets
+3,3V: proj_arhipov_mcu (22 pins), proj_arhipov_buck (6 pins), proj_arhipov_uart_rs232 (C43.2 DD5.18 DD5.19), proj_arhipov_elements_control (C32.2 X6.1)
+12V: proj_arhipov_buck (5 pins), proj_arhipov_elements_control (VD10.1 VD11.1 X4.1 X5.2)
GND: proj_arhipov_mcu (23 pins), proj_arhipov_buck (37 pins), proj_arhipov_uart_rs232 (7 pins), proj_arhipov_elements_control (5 pins)
MCU_~{FORCEOFF}: proj_arhipov_mcu (DD1.84), proj_arhipov_uart_rs232 (DD5.14)
MCU_FLT_EFUSE: proj_arhipov_mcu (DD1.9), proj_arhipov_buck (DD4.15 R30.1)
MCU_~{INVALID}: proj_arhipov_mcu (DD1.85), proj_arhipov_uart_rs232 (DD5.13)
MCU_IMON_EFUSE: proj_arhipov_mcu (DD1.25), proj_arhipov_buck (DD4.14 R31.2)
MCU_LOCK: proj_arhipov_mcu (DD1.63), proj_arhipov_elements_control (R23.1)
MCU_RX_IN_1: proj_arhipov_mcu (DD1.69), proj_arhipov_uart_rs232 (DD5.12)
MCU_RX_IN_2: proj_arhipov_mcu (DD1.87), proj_arhipov_uart_rs232 (DD5.11)
MCU_SENSOR: proj_arhipov_mcu (DD1.1), proj_arhipov_elements_control (R22.1)
MCU_TX_IN_1: proj_arhipov_mcu (DD1.68), proj_arhipov_uart_rs232 (DD5.10)
MCU_TX_IN_2: proj_arhipov_mcu (DD1.86), proj_arhipov_uart_rs232 (DD5.9)